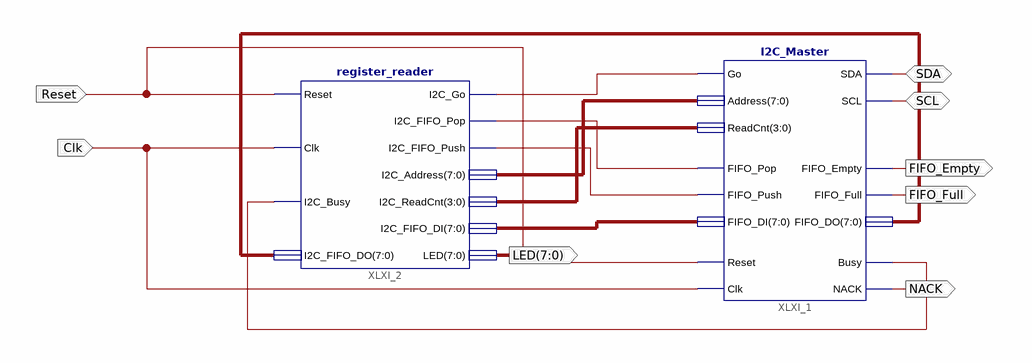
[diagram p0: schematic sheet 1]
// Xilinx ISE schematic register_reader_i2c.sch (spartan3e) as structural Verilog: 2 symbols, 8 ports
module register_reader_i2c (
  input  Clk,
  input  Reset,
  inout  SDA,
  inout  SCL,
  output FIFO_Empty,
  output FIFO_Full,
  output NACK,
  output [7:0] LED
);

  wire XLXN_1, XLXN_2, XLXN_3, XLXN_8;
  wire [3:0] XLXN_5;
  wire [7:0] XLXN_4, XLXN_6, XLXN_7;

  I2C_Master XLXI_1 (
    .Go(XLXN_1), .Address(XLXN_4), .ReadCnt(XLXN_5), .SDA(SDA), .SCL(SCL), .FIFO_Pop(XLXN_2),
    .FIFO_Push(XLXN_3), .FIFO_DI(XLXN_6), .FIFO_Empty(FIFO_Empty), .FIFO_Full(FIFO_Full), .FIFO_DO(XLXN_7),
    .Reset(Reset), .Clk(Clk), .Busy(XLXN_8), .NACK(NACK));
  register_reader XLXI_2 (
    .Reset(Reset), .Clk(Clk), .I2C_Busy(XLXN_8), .I2C_FIFO_DO(XLXN_7), .I2C_Go(XLXN_1),
    .I2C_FIFO_Pop(XLXN_2), .I2C_FIFO_Push(XLXN_3), .I2C_Address(XLXN_4), .I2C_ReadCnt(XLXN_5),
    .I2C_FIFO_DI(XLXN_6), .LED(LED));
endmodule
